# Altium schematic sheet [03] - Power.SchDoc
size A4
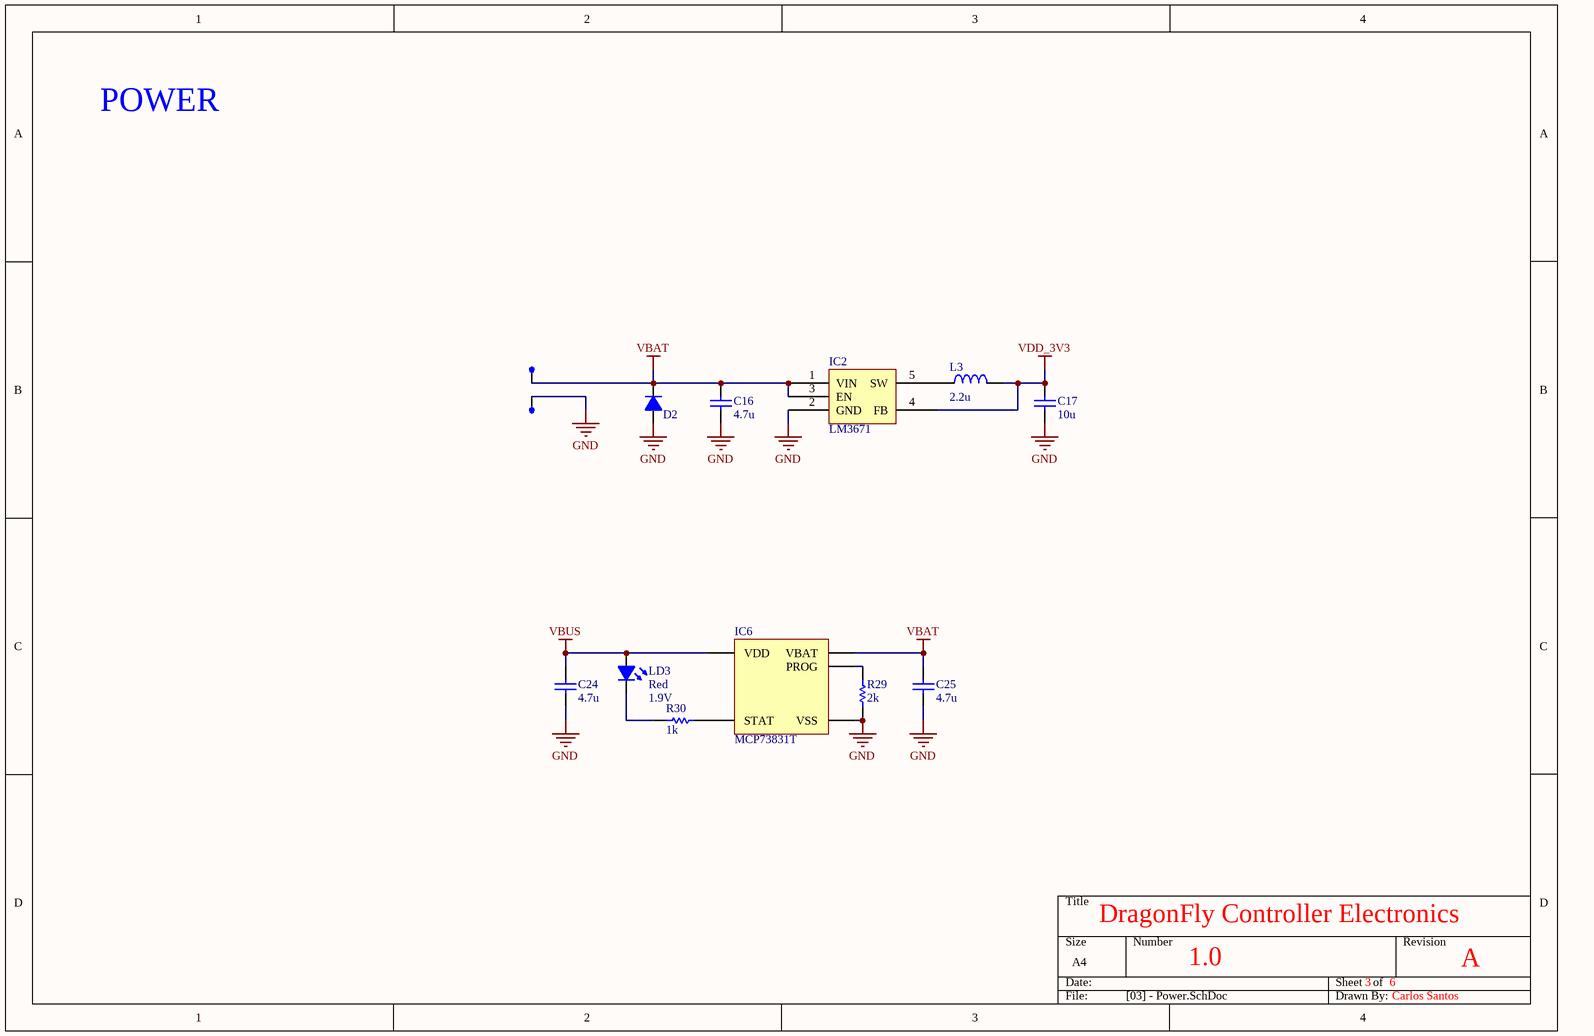
[diagram p0: [03] - Power.SchDoc]

## Parts
C16  value 4.7u  [0603 - Capacitor]  (hidden comment: Capacitor)
C17  value 10u  [0603 - Capacitor]  (hidden comment: Capacitor)
C24  value 4.7u  [0402 - Capacitor]  (hidden comment: Capacitor)
C25  value 4.7u  [0402 - Capacitor]  (hidden comment: Capacitor)
D2  Diode  [SOD 923]  (value not drawn)
IC2  LM3671  [SOT 23 - 5]
IC6  MCP73831T  [QFN50P300X200X100_HS-9N]
L3  value 2.2u  [MDMK2020]  (hidden comment: Inductor)
LD3  Color: Red  Vf: 1.9V  [0603 - led]  (hidden comment: Led)
R29  value 2k  [0402 - Resistor]  (hidden comment: Resistor)
R30  value 1k  [0402 - Resistor]  (hidden comment: Resistor)
SP3  Signal Point  [Signal_point_1mm]  (value not drawn)
SP4  Signal Point  [Signal_point_1mm]  (value not drawn)

## Nets
GND: C16.1 C17.1 C24.1 C25.1 D2.1(A) IC2.2(GND) IC6.2(VSS) R29.1 SP4.0(VIN)
VBAT: C16.2 C25.2 D2.2(K) IC2.1(VIN) IC2.3(EN) IC6.3(VBAT) SP3.0(VIN)
VBUS: C24.2 IC6.4(VDD) LD3.1(A)
VDD_3V3: C17.2 IC2.4(FB) L3.2
NetIC2_5: IC2.5(SW) L3.1
NetIC6_1: IC6.1(STAT) R30.1
NetIC6_5: IC6.5(PROG) R29.2
NetLD3_2: LD3.2(K) R30.2

## Notes on the sheet
- POWER
- DragonFly Controller Electronics
- 1.0
- 3
- 6
- A
- Carlos Santos

## Library data of the parts
IC6 = Lipo Charger: MCP73831T-2ACI/OTCT-ND; DigiKey Part #: MCP73831T-2ACI/MCCT-ND
SP3 SP4 = Signal Point: Value: DNP
D2 = Diode: DigiKey Part #: *
IC2 = LM3671: DigiKey Part #: LM3671MF-3.3/NOPBCT-ND